# EAGLE schematic SmartMirror (EAGLE 9.6.2)
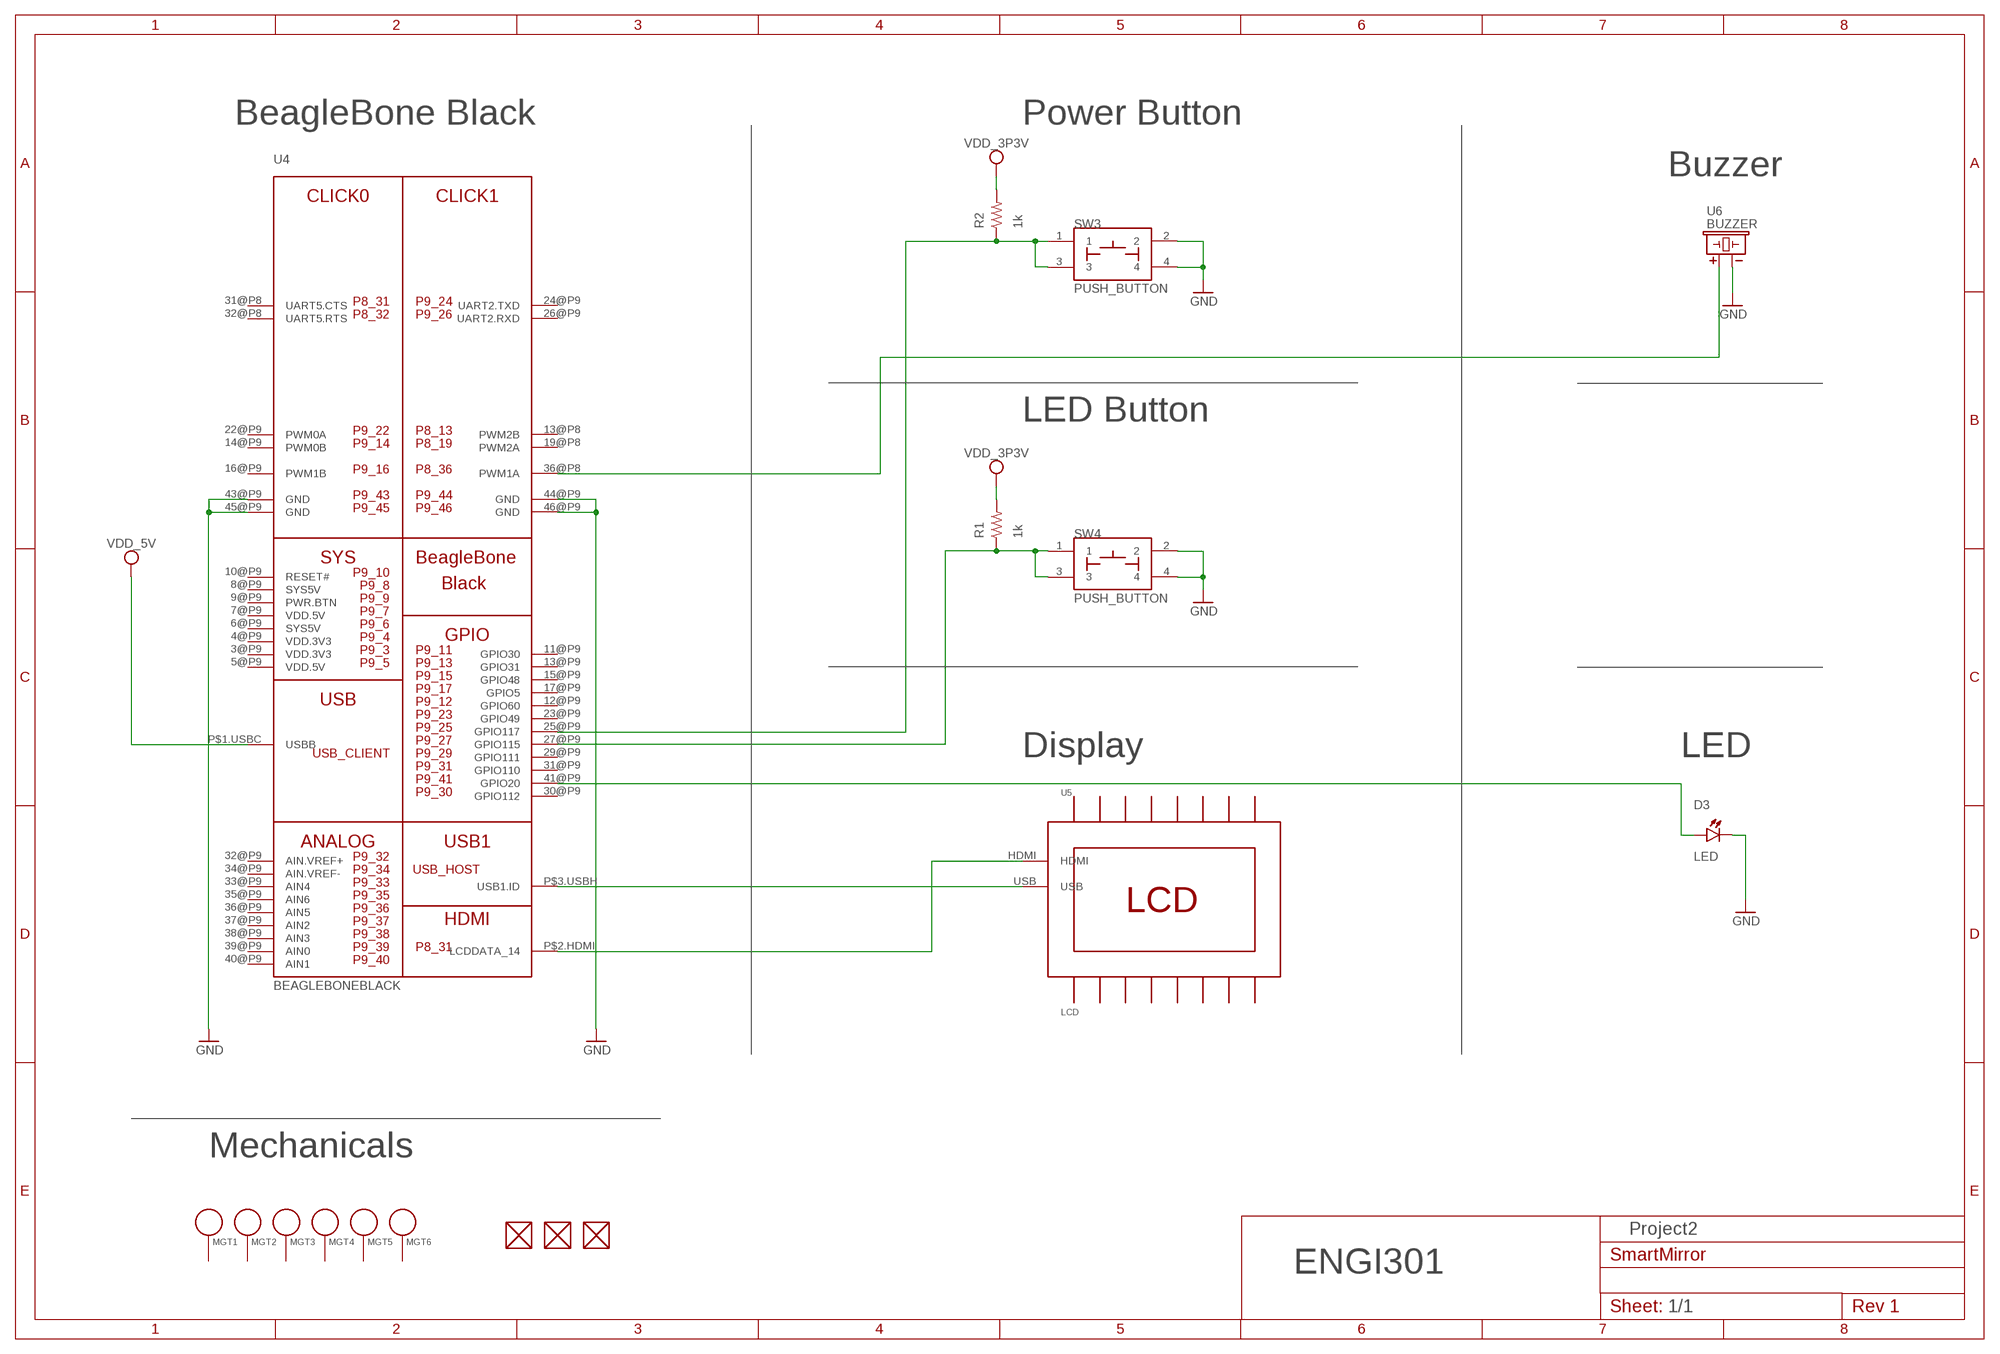
[diagram p0: schematic, sheet 1]

## Parts
D3  LED  [EIA-STD]
FUD1  FIDUCIAL  [FIDUCIAL_40MIL]
FUD2  FIDUCIAL  [FIDUCIAL_40MIL]
FUD3  FIDUCIAL  [FIDUCIAL_40MIL]
MGT1  MOUNTING_HOLE  [MOUNTING_HOLE]
MGT2  MOUNTING_HOLE  [MOUNTING_HOLE]
MGT3  MOUNTING_HOLE  [MOUNTING_HOLE]
MGT4  MOUNTING_HOLE  [MOUNTING_HOLE]
MGT5  MOUNTING_HOLE  [MOUNTING_HOLE]
MGT6  MOUNTING_HOLE  [MOUNTING_HOLE]
R1  1k  R_R0402  [R0402]
R2  1k  R_R0402  [R0402]
SW3  PUSH_BUTTON  [BUTTON_12.5MM]
SW4  PUSH_BUTTON  [BUTTON_12.5MM]
U4  BEAGLEBONEBLACK  [BEAGLEBONEBLACK]
U5  LCD  [LCD]
U6  BUZZER  [BUZZER_6.5MM]

## Nets
GND: D3.CATHODE SW3.2 SW3.4 SW4.2 SW4.4 U4.43@P9(GND) U4.44@P9(GND) U4.45@P9(GND) U4.46@P9(GND) U6.-
N$1: U4.P$2.HDMI(LCDDATA_14) U5.HDMI
N$2: U4.P$3.USBH(USB1.ID) U5.USB
N$3: R1.1 SW4.1 SW4.3 U4.27@P9(GPIO115)
N$4: U4.36@P8(PWM1A) U6.+
N$5: D3.ANODE U4.41@P9(GPIO20)
N$7: R2.1 SW3.1 SW3.3 U4.25@P9(GPIO117)
VDD_3P3V: R1.2 R2.2
VDD_5V: U4.P$1.USBC(USBB)
Unconnected: FUD1.P$1 FUD2.P$1 FUD3.P$1 MGT1.P$1 MGT2.P$1 MGT3.P$1 MGT4.P$1 MGT5.P$1 MGT6.P$1 U4.4@P9(VDD.3V3) U4.5@P9(VDD.5V) U4.7@P9(VDD.5V) U4.8@P9(SYS5V) U4.9@P9(PWR.BTN) U4.10@P9(RESET#) U4.11@P9(GPIO30) U4.12@P9(GPIO60) U4.13@P8(PWM2B) U4.13@P9(GPIO31) U4.14@P9(PWM0B) U4.15@P9(GPIO48) U4.16@P9(PWM1B) U4.17@P9(GPIO5) U4.19@P8(PWM2A) U4.22@P9(PWM0A) U4.23@P9(GPIO49) U4.24@P9(UART2.TXD) U4.26@P9(UART2.RXD) U4.29@P9(GPIO111) U4.30@P9(GPIO112) U4.31@P8(UART5.CTS) U4.31@P9(GPIO110) U4.32@P8(UART5.RTS) U4.32@P9(AIN.VREF+) U4.33@P9(AIN4) U4.34@P9(AIN.VREF-) U4.35@P9(AIN6) U4.36@P9(AIN5) U4.37@P9(AIN2) U4.38@P9(AIN3) U4.39@P9(AIN0) U4.40@P9(AIN1)

## Notes on the sheet
- BeagleBone Black | Power Button
- Buzzer
- LED Button
- Display | LED
- Mechanicals
- Project2
- ENGI301
- 1/1

## Power pins joined to a net without a drawn wire
SYS5V: U4.6@P9(SYS5V)
VDD.3V3: U4.3@P9(VDD.3V3)

## Library data of the parts
D3 = MISC:LED: EIA-STD LED; LTST-C191TBKT
FUD1-FUD3 = MISC:FIDUCIAL
MGT1-MGT6 = MISC:MOUNTING_HOLE: Chassis Mounting Hole w/GND connection ability
R1 R2 = MISC:R_: RESISTOR, American symbol
SW3 SW4 = MISC:PUSH_BUTTON
U4 = MISC:BEAGLEBONEBLACK
U5 = MISC:LCD
U6 = MISC:BUZZER: CEM-1203 Buzzer